# Altium project project.PrjPcb
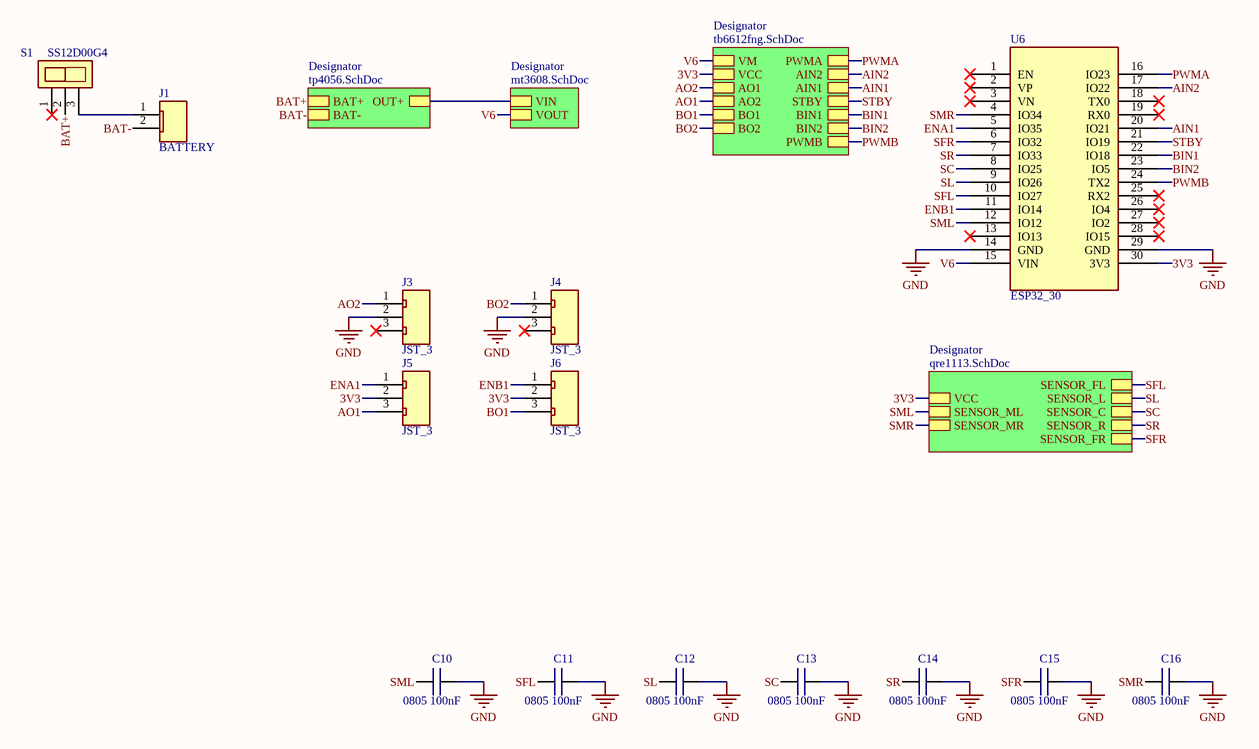
[diagram p0: schematic.SchDoc]
5 sheets, 61 parts. Net scope: hierarchical (ports join the sheet entries above them; power ports are global).
Board file: pcb.PcbDoc
Sheets:
  schematic.SchDoc
    Designator = mt3608.SchDoc
    Designator = tp4056.SchDoc
    Designator = tb6612fng.SchDoc
    Designator = qre1113.SchDoc

## Sheet schematic.SchDoc
size A4; SheetNumber: 1; SheetTotal: 5

### Parts
C10  0805 100nF  [CAPACITOR 0805]
C11  0805 100nF  [CAPACITOR 0805]
C12  0805 100nF  [CAPACITOR 0805]
C13  0805 100nF  [CAPACITOR 0805]
C14  0805 100nF  [CAPACITOR 0805]
C15  0805 100nF  [CAPACITOR 0805]
C16  0805 100nF  [CAPACITOR 0805]
J1  BATTERY  [JST_2]
J3  JST_3  [JST_3]
J4  JST_3  [JST_3]
J5  JST_3  [JST_3]
J6  JST_3  [JST_3]
S1  SS12D00G4  [SS12D00G4]
U6  ESP32_30  [ESP32_30]

### Sub-sheets
Designator = mt3608.SchDoc: VIN, VOUT
Designator = tp4056.SchDoc: BAT+, OUT+, BAT-
Designator = tb6612fng.SchDoc: VM, VCC, AO1, AO2, BO1, BO2, PWMA, AIN2, AIN1, STBY, BIN1, BIN2, PWMB
Designator = qre1113.SchDoc: SENSOR_FL, SENSOR_L, SENSOR_R, SENSOR_C, SENSOR_FR, SENSOR_ML, SENSOR_MR, VCC

### Nets
GND: C10.2 C11.2 C12.2 C13.2 C14.2 C15.2 C16.2 J3.2 J4.2 U6.14(GND) U6.29(GND)
3V3: J5.2 J6.2 U6.30(3V3) ; sheet Designator/VCC, sheet Designator/VCC
AIN1: U6.20(IO21) ; sheet Designator/AIN1
AIN2: U6.17(IO22) ; sheet Designator/AIN2
AO1: J5.3 ; sheet Designator/AO2
AO2: J3.1 ; sheet Designator/AO1
BAT+: S1.2 ; sheet Designator/VIN, sheet Designator/BAT+, sheet Designator/OUT+
BAT-: J1.2 ; sheet Designator/BAT-
BIN1: U6.22(IO18) ; sheet Designator/BIN1
BIN2: U6.23(IO5) ; sheet Designator/BIN2
BO1: J6.3 ; sheet Designator/BO1
BO2: J4.1 ; sheet Designator/BO2
ENA1: J5.1 U6.5(IO35)
ENB1: J6.1 U6.11(IO14)
PWMA: U6.16(IO23) ; sheet Designator/PWMA
PWMB: U6.24(TX2) ; sheet Designator/PWMB
SC: C13.1 U6.8(IO25) ; sheet Designator/SENSOR_C
SFL: C11.1 U6.10(IO27) ; sheet Designator/SENSOR_FL
SFR: C15.1 U6.6(IO32) ; sheet Designator/SENSOR_FR
SL: C12.1 U6.9(IO26) ; sheet Designator/SENSOR_L
SML: C10.1 U6.12(IO12) ; sheet Designator/SENSOR_ML
SMR: C16.1 U6.4(IO34) ; sheet Designator/SENSOR_MR
SR: C14.1 U6.7(IO33) ; sheet Designator/SENSOR_R
STBY: U6.21(IO19) ; sheet Designator/STBY
V6: U6.15(VIN) ; sheet Designator/VOUT, sheet Designator/VM
NetJ1_1: J1.1 S1.3

Not connected (* = marked no-connect by the designer): J3 3*; J4 3*; S1 1*; U6 1(EN)* 2(VP)* 3(VN)* 13(IO13)* 18(TX0)* 19(RX0)* 25(RX2)* 26(IO4)* 27(IO2)* 28(IO15)*

### Library data of the parts
C10-C16 = CAPACITOR 0805
J1 = JST_2
U6 = ESP32_30: Microcontoller Board 30 Pins Wifi 2.4GHz BLE 4.2 ESP32-WROOM-32D; ComponentLink1Description: Datasheet; ComponentLink1URL: https://www.mouser.com/datasheet/2/891/esp32_wroom_32d_esp32_wroom_32u_datasheet_en-1365844.pdf

## Sheet mt3608.SchDoc
size A4; SheetNumber: 3; SheetTotal: 3
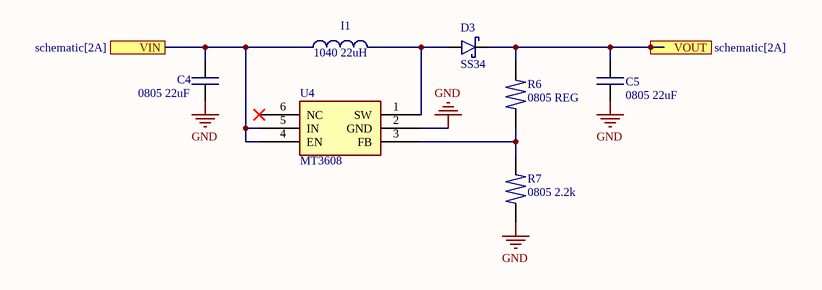
[diagram p1: mt3608.SchDoc]

### Parts
C4  0805 22uF  [CAPACITOR 0805]
C5  0805 22uF  [CAPACITOR 0805]
D3  SS34  [SS34]
I1  1040 22uH  [1040]
R6  0805 REG  [RESISTOR_0805]
R7  0805 2.2k  [RESISTOR_0805]
U4  MT3608  [MT3608]

### Ports
VIN (see schematic[2A]), VOUT (see schematic[2A])

### Nets
GND: C4.1 C5.1 R7.1 U4.2(GND)
BAT+: C4.2 I1.1 U4.4(EN) U4.5(IN) ; port VIN
V6: C5.2 D3.2 R6.2 ; port VOUT
NetD3_1: D3.1 I1.2 U4.1(SW)
NetR6_1: R6.1 R7.2 U4.3(FB)

Not connected (* = marked no-connect by the designer): U4 6(NC)*

### Library data of the parts
C4 C5 = CAPACITOR 0805
D3 = SS34: Rectifier Schottky 40V 3A SMC; Mouser PN: 512-SS34; ComponentLink1Description: Datasheet; Digikey PN: SS34FSTR-ND
I1 = 1040
R6 R7 = RESISTOR_0805
U4 = MT3608: IC BUCK STEP UP 2A SOT23-6; ComponentLink1Description: Datasheet; ComponentLink1URL: https://www.olimex.com/Products/Breadboarding/BB-PWR-3608/resources/MT3608.pdf

## Sheet tp4056.SchDoc
size A4; SheetNumber: 2; SheetTotal: 5
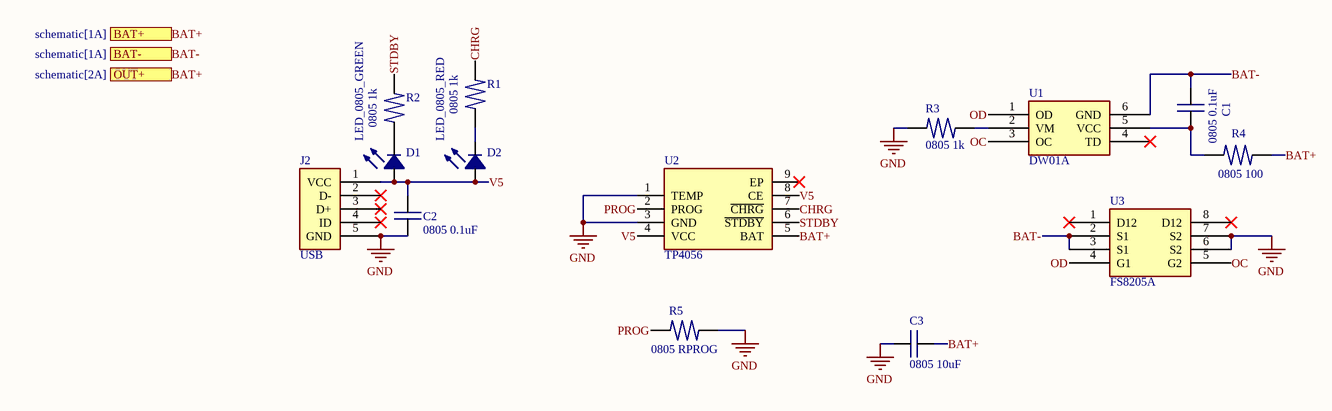
[diagram p2: tp4056.SchDoc]

### Parts
C1  0805 0.1uF  [CAPACITOR 0805]
C2  0805 0.1uF  [CAPACITOR 0805]
C3  0805 10uF  [CAPACITOR 0805]
D1  LED_0805_GREEN  [LED_0805_GREEN]
D2  LED_0805_RED  [LED_0805_RED]
J2  USB  [USB]
R1  0805 1k  [RESISTOR_0805]
R2  0805 1k  [RESISTOR_0805]
R3  0805 1k  [RESISTOR_0805]
R4  0805 100  [RESISTOR_0805]
R5  0805 RPROG  [RESISTOR_0805]
U1  DW01A  [DW01A]
U2  TP4056  [TP4056]
U3  FS8205A  [FS8205A]

### Ports
BAT+ (see schematic[1A]), BAT- (see schematic[1A]), OUT+ (see schematic[2A])

### Nets
GND: C2.1 C3.1 J2.5(GND) R3.2 R5.2 U2.1(TEMP) U2.3(GND) U3.6(S2) U3.7(S2)
BAT+: C3.2 R4.2 U2.5(BAT) ; port BAT+, port OUT+
BAT-: C1.2 U1.6(GND) U3.2(S1) U3.3(S1) ; port BAT-
CHRG: R1.2 U2.7(~{CHRG})
OC: U1.3(OC) U3.5(G2)
OD: U1.1(OD) U3.4(G1)
PROG: R5.1 U2.2(PROG)
STDBY: R2.2 U2.6(~{STDBY})
V5: C2.2 D1.1 D2.1 J2.1(VCC) U2.4(VCC) U2.8(CE)
NetC1_1: C1.1 R4.1 U1.5(VCC)
NetD1_2: D1.2 R2.1
NetD2_2: D2.2 R1.1
NetR3_1: R3.1 U1.2(VM)

Not connected (* = marked no-connect by the designer): J2 2(D-)* 3(D+)* 4(ID)*; U1 4(TD)*; U2 9(EP)*; U3 1(D12)* 8(D12)*

### Library data of the parts
C1-C3 = CAPACITOR 0805
R1-R5 = RESISTOR_0805
U1 = DW01A: BATTERY PROTECTION IC
U2 = TP4056: CHIP BATTERY CHARGER
U3 = FS8205A: 20V DUAL N-CHANNEL MOSFET TSSOP-8; ComponentLink1Description: Datasheet; ComponentLink1URL: https://www.ic-fortune.com/upload/Download/FS8205A-DS-12_EN.pdf

## Sheet tb6612fng.SchDoc
size A4; SheetNumber: 4; SheetTotal: 4
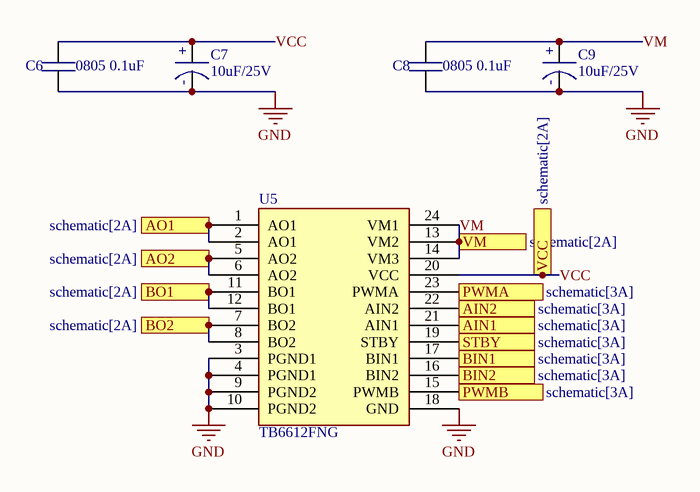
[diagram p3: tb6612fng.SchDoc]

### Parts
C6  0805 0.1uF  [CAPACITOR 0805]
C7  10uF/25V  [10uF/25V 4mm]
C8  0805 0.1uF  [CAPACITOR 0805]
C9  10uF/25V  [10uF/25V 4mm]
U5  TB6612FNG  [TB6612FNG]

### Ports
AIN1 (see schematic[3A]), AIN2 (see schematic[3A]), AO1 (see schematic[2A]), AO2 (see schematic[2A]), BIN1 (see schematic[3A]), BIN2 (see schematic[3A]), BO1 (see schematic[2A]), BO2 (see schematic[2A]), PWMA (see schematic[3A]), PWMB (see schematic[3A]), STBY (see schematic[3A]), VCC (see schematic[2A]), VM (see schematic[2A])

### Nets
GND: C6.1 C7.1 C8.1 C9.1 U5.3(PGND1) U5.4(PGND1) U5.9(PGND2) U5.10(PGND2) U5.18(GND)
AIN1: U5.21(AIN1) ; port AIN1
AIN2: U5.22(AIN2) ; port AIN2
AO1: U5.5(AO2) U5.6(AO2) ; port AO2
AO2: U5.1(AO1) U5.2(AO1) ; port AO1
BIN1: U5.17(BIN1) ; port BIN1
BIN2: U5.16(BIN2) ; port BIN2
BO1: U5.11(BO1) U5.12(BO1) ; port BO1
BO2: U5.7(BO2) U5.8(BO2) ; port BO2
PWMA: U5.23(PWMA) ; port PWMA
PWMB: U5.15(PWMB) ; port PWMB
STBY: U5.19(STBY) ; port STBY
VCC: C6.2 C7.2 U5.20(VCC) ; port VCC  [project net 3V3]
VM: C8.2 C9.2 U5.13(VM2) U5.14(VM3) U5.24(VM1) ; port VM  [project net V6]

### Notes on the sheet
- (in symbol 10uF/25V) +; -

### Library data of the parts
C6 C8 = CAPACITOR 0805
C7 C9 = 10uF/25V: Electrolytic Capacitor 10uF/25V
U5 = TB6612FNG: Dual Motor Driver 2.5-13.5V 3.2A Peak SSOP24-P-300-0.65A; ComponentLink1Description: Datasheet; ComponentLink1URL: https://www.mouser.com/datasheet/2/408/TB6612FNG_datasheet_en_20141001-708260.pdf; Mouser PN: 757-TB6612FNGC8EL; Digikey PN: TB6612FNGC8ELCT-ND

## Sheet qre1113.SchDoc
size A4; SheetNumber: 5; SheetTotal: 5
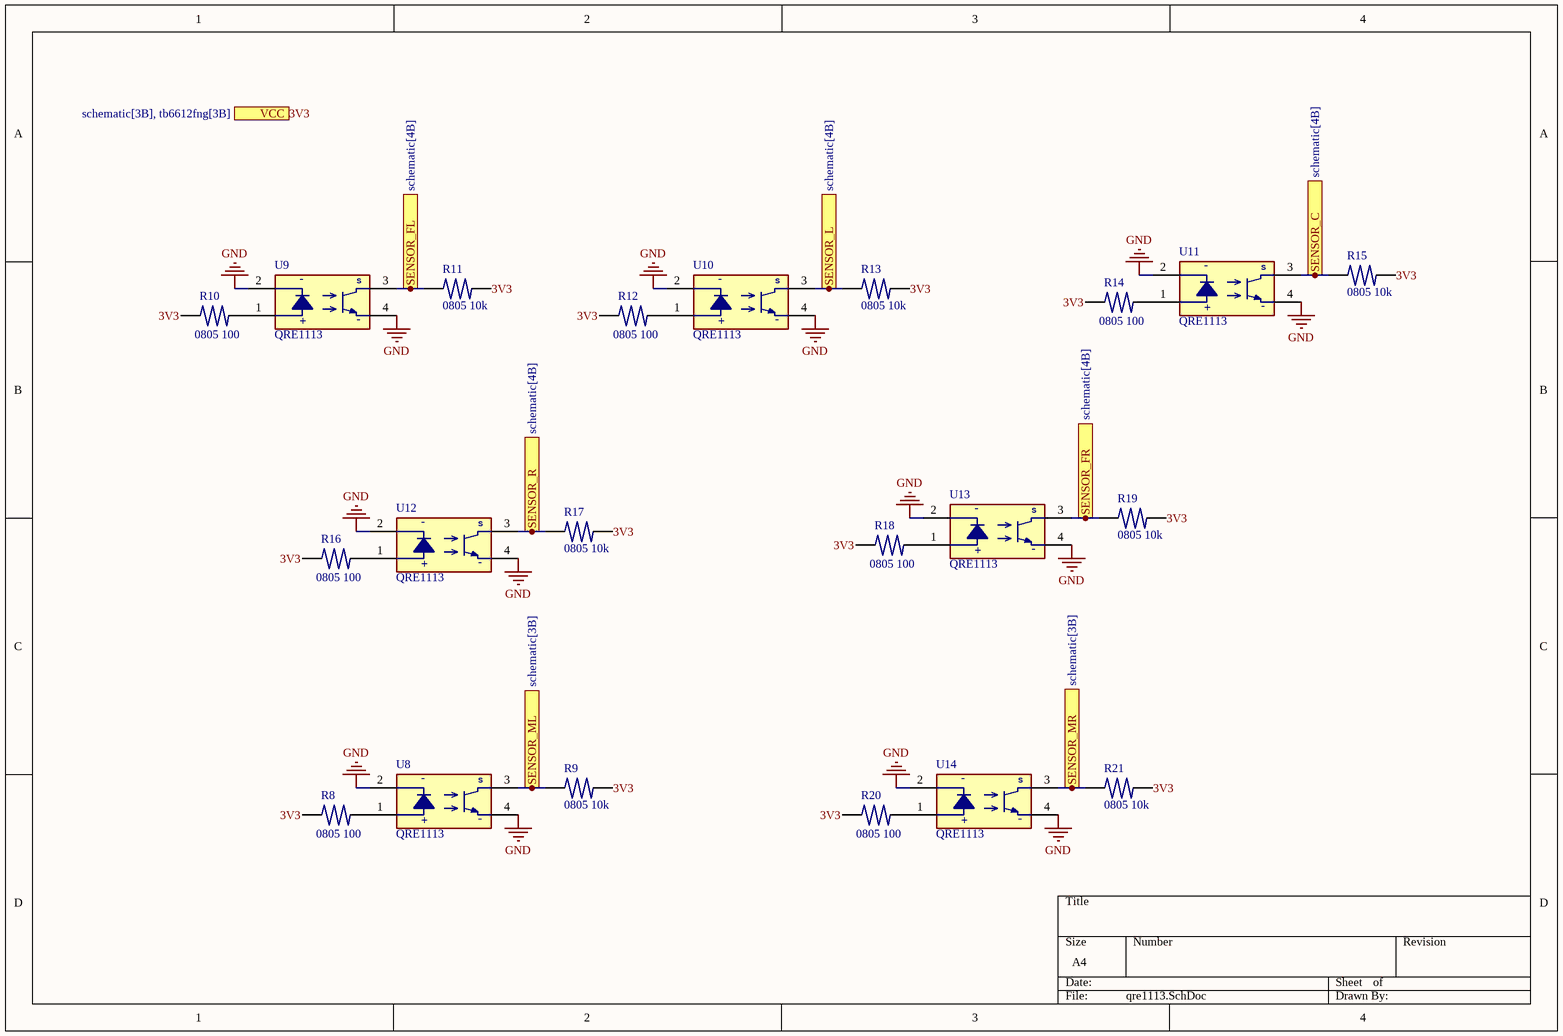
[diagram p4: qre1113.SchDoc]

### Parts
R8  0805 100  [RESISTOR_0805]
R9  0805 10k  [RESISTOR_0805]
R10  0805 100  [RESISTOR_0805]
R11  0805 10k  [RESISTOR_0805]
R12  0805 100  [RESISTOR_0805]
R13  0805 10k  [RESISTOR_0805]
R14  0805 100  [RESISTOR_0805]
R15  0805 10k  [RESISTOR_0805]
R16  0805 100  [RESISTOR_0805]
R17  0805 10k  [RESISTOR_0805]
R18  0805 100  [RESISTOR_0805]
R19  0805 10k  [RESISTOR_0805]
R20  0805 100  [RESISTOR_0805]
R21  0805 10k  [RESISTOR_0805]
U8  QRE1113  [QRE1113]
U9  QRE1113  [QRE1113]
U10  QRE1113  [QRE1113]
U11  QRE1113  [QRE1113]
U12  QRE1113  [QRE1113]
U13  QRE1113  [QRE1113]
U14  QRE1113  [QRE1113]

### Ports
SENSOR_C (see schematic[4B]), SENSOR_FL (see schematic[4B]), SENSOR_FR (see schematic[4B]), SENSOR_L (see schematic[4B]), SENSOR_ML (see schematic[3B]), SENSOR_MR (see schematic[3B]), SENSOR_R (see schematic[4B]), VCC (see schematic[3B], tb6612fng[3B])

### Nets
GND: U8.2(GND) U8.4(GND) U9.2(GND) U9.4(GND) U10.2(GND) U10.4(GND) U11.2(GND) U11.4(GND) U12.2(GND) U12.4(GND) U13.2(GND) U13.4(GND) U14.2(GND) U14.4(GND)
3V3: R8.1 R9.2 R10.1 R11.2 R12.1 R13.2 R14.1 R15.2 R16.1 R17.2 R18.1 R19.2 R20.1 R21.2 ; port VCC
SC: R15.1 U11.3(SIGNAL) ; port SENSOR_C
SFL: R11.1 U9.3(SIGNAL) ; port SENSOR_FL
SFR: R19.1 U13.3(SIGNAL) ; port SENSOR_FR
SL: R13.1 U10.3(SIGNAL) ; port SENSOR_L
SML: R9.1 U8.3(SIGNAL) ; port SENSOR_ML
SMR: R21.1 U14.3(SIGNAL) ; port SENSOR_MR
SR: R17.1 U12.3(SIGNAL) ; port SENSOR_R
NetR8_2: R8.2 U8.1(VCC)
NetR10_2: R10.2 U9.1(VCC)
NetR12_2: R12.2 U10.1(VCC)
NetR14_2: R14.2 U11.1(VCC)
NetR16_2: R16.2 U12.1(VCC)
NetR18_2: R18.2 U13.1(VCC)
NetR20_2: R20.2 U14.1(VCC)

### Notes on the sheet
- (in symbol QRE1113) -; S; +

### Library data of the parts
R8-R21 = RESISTOR_0805
U8-U14 = QRE1113: REFLECTIVE OPTICAL SENSOR SMD; Digikey PN: 512-QRE1113GR; ComponentLink1Description: Datasheet; ComponentLink1URL: https://br.mouser.com/datasheet/2/308/QRE1113_D-1814544.pdf

## Nets that join several sheets
GND: schematic (11 pins), mt3608 (C4.1 C5.1 R7.1 U4.2), tp4056 (9 pins), tb6612fng (9 pins), qre1113 (14 pins)
3V3: schematic (J5.2 J6.2 U6.30), tb6612fng (C6.2 C7.2 U5.20), qre1113 (14 pins)
AIN1: schematic (U6.20), tb6612fng (U5.21)
AIN2: schematic (U6.17), tb6612fng (U5.22)
AO1: schematic (J5.3), tb6612fng (U5.5 U5.6)
AO2: schematic (J3.1), tb6612fng (U5.1 U5.2)
BAT+: schematic (S1.2), mt3608 (C4.2 I1.1 U4.4 U4.5), tp4056 (C3.2 R4.2 U2.5)
BAT-: schematic (J1.2), tp4056 (C1.2 U1.6 U3.2 U3.3)
BIN1: schematic (U6.22), tb6612fng (U5.17)
BIN2: schematic (U6.23), tb6612fng (U5.16)
BO1: schematic (J6.3), tb6612fng (U5.11 U5.12)
BO2: schematic (J4.1), tb6612fng (U5.7 U5.8)
PWMA: schematic (U6.16), tb6612fng (U5.23)
PWMB: schematic (U6.24), tb6612fng (U5.15)
SC: schematic (C13.1 U6.8), qre1113 (R15.1 U11.3)
SFL: schematic (C11.1 U6.10), qre1113 (R11.1 U9.3)
SFR: schematic (C15.1 U6.6), qre1113 (R19.1 U13.3)
SL: schematic (C12.1 U6.9), qre1113 (R13.1 U10.3)
SML: schematic (C10.1 U6.12), qre1113 (R9.1 U8.3)
SMR: schematic (C16.1 U6.4), qre1113 (R21.1 U14.3)
SR: schematic (C14.1 U6.7), qre1113 (R17.1 U12.3)
STBY: schematic (U6.21), tb6612fng (U5.19)
V6: schematic (U6.15), mt3608 (C5.2 D3.2 R6.2), tb6612fng (5 pins)